# Altium project DCS_MCU.PrjPcb
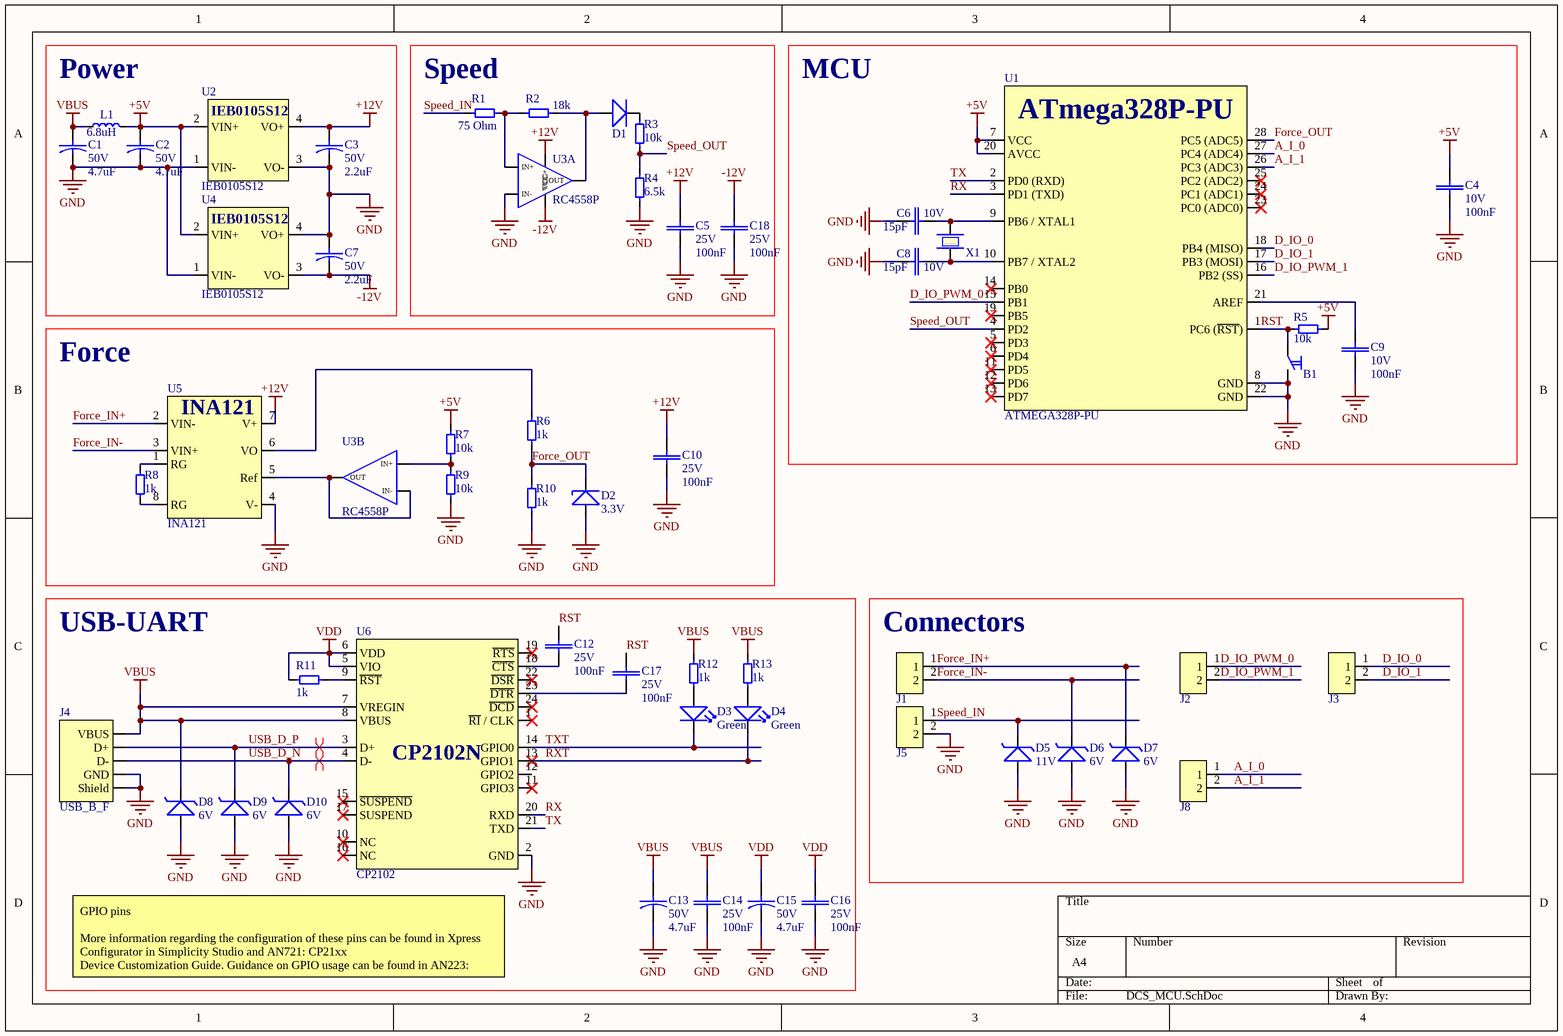
[diagram p0: DCS_MCU.SchDoc]
1 sheet, 55 parts. Net scope: global (net labels, ports and power ports of the same name join across sheets).
Board file: DCS_MCU.PcbDoc

## Sheet DCS_MCU.SchDoc
size A4; SheetNumber: 1; SheetTotal: 1

### Parts
B1  Button_SPST  [Button_small]  (value not drawn)
C1  value 4.7uF  Voltage: 50V  [CAPPRD200W50D400H800]  (hidden comment: Capacitor_NP)
C2  value 4.7uF  Voltage: 50V  [CAPPRD200W50D400H800]  (hidden comment: Capacitor_NP)
C3  value 2.2uF  Voltage: 50V  [CAPPRD200W50D400H800]  (hidden comment: Capacitor_NP)
C4  value 100nF  Voltage: 10V  [CAPRD500W50D400H600]  (hidden comment: Capacitor_NP)
C5  value 100nF  Voltage: 25V  [CAPRD500W50D400H600]  (hidden comment: Capacitor_NP)
C6  value 15pF  Voltage: 10V  [CAPRD500W50D400H600]  (hidden comment: Capacitor_NP)
C7  value 2.2uF  Voltage: 50V  [CAPPRD200W50D400H800]  (hidden comment: Capacitor_NP)
C8  value 15pF  Voltage: 10V  [CAPRD500W50D400H600]  (hidden comment: Capacitor_NP)
C9  value 100nF  Voltage: 10V  [CAPRD500W50D400H600]  (hidden comment: Capacitor_NP)
C10  value 100nF  Voltage: 25V  [CAPRD500W50D400H600]  (hidden comment: Capacitor_NP)
C12  value 100nF  Voltage: 25V  [CAPRD500W50D400H600]  (hidden comment: Capacitor_NP)
C13  value 4.7uF  Voltage: 50V  [CAPPRD200W50D400H800]  (hidden comment: Capacitor_NP)
C14  value 100nF  Voltage: 25V  [CAPRD500W50D400H600]  (hidden comment: Capacitor_NP)
C15  value 4.7uF  Voltage: 50V  [CAPPRD200W50D400H800]  (hidden comment: Capacitor_NP)
C16  value 100nF  Voltage: 25V  [CAPRD500W50D400H600]  (hidden comment: Capacitor_NP)
C17  value 100nF  Voltage: 25V  [CAPRD500W50D400H600]  (hidden comment: Capacitor_NP)
C18  value 100nF  Voltage: 25V  [CAPRD500W50D400H600]  (hidden comment: Capacitor_NP)
D1  Diode  [DIOAD450W35L350D200]  (value not drawn)
D2  Voltage: 3.3V  [DIOAD450W35L350D200]  (hidden comment: Diode_Zener)
D3  Color: Green  [LEDRD254W60D600H1000]  (hidden comment: Diode_LED)
D4  Color: Green  [LEDRD254W60D600H1000]  (hidden comment: Diode_LED)
D5  Voltage: 11V  [DIOAD450W35L350D200]  (hidden comment: Diode_TVS)
D6  Voltage: 6V  [DIOAD450W35L350D200]  (hidden comment: Diode_TVS)
D7  Voltage: 6V  [DIOAD450W35L350D200]  (hidden comment: Diode_TVS)
D8  Voltage: 6V  [DIOAD450W35L350D200]  (hidden comment: Diode_TVS)
D9  Voltage: 6V  [DIOAD450W35L350D200]  (hidden comment: Diode_TVS)
D10  Voltage: 6V  [DIOAD450W35L350D200]  (hidden comment: Diode_TVS)
J1  Terminal_2-pole  [Terminal_2-pole]  (value not drawn)
J2  Terminal_2-pole  [Terminal_2-pole]  (value not drawn)
J3  Terminal_2-pole  [Terminal_2-pole]  (value not drawn)
J4  USB_B_F  [USB_B_F]
J5  Terminal_2-pole  [Terminal_2-pole]  (value not drawn)
J8  Terminal_2-pole  [Terminal_2-pole]  (value not drawn)
L1  value 6.8uH  [INDRD360W60D650H1000]  (hidden comment: Inductor)
R1  value 75 Ohm  [RESAD710W60L610D260]  (hidden comment: Resistor)
R2  value 18k  [RESAD710W60L610D260]  (hidden comment: Resistor)
R3  value 10k  [RESAD710W60L610D260]  (hidden comment: Resistor)
R4  value 6.5k  [RESAD710W60L610D260]  (hidden comment: Resistor)
R5  value 10k  [RESAD710W60L610D260]  (hidden comment: Resistor)
R6  value 1k  [RESAD710W60L610D260]  (hidden comment: Resistor)
R7  value 10k  [RESAD710W60L610D260]  (hidden comment: Resistor)
R8  value 1k  [RESAD710W60L610D260]  (hidden comment: Resistor)
R9  value 10k  [RESAD710W60L610D260]  (hidden comment: Resistor)
R10  value 1k  [RESAD710W60L610D260]  (hidden comment: Resistor)
R11  value 1k  [RESAD710W60L610D260]  (hidden comment: Resistor)
R12  value 1k  [RESAD710W60L610D260]  (hidden comment: Resistor)
R13  value 1k  [RESAD710W60L610D260]  (hidden comment: Resistor)
U1  ATMEGA328P-PU  [DIP790W46P254L3556H508Q28]
U2  IEB0105S12  [SIP600W50P254L1160H1016Q4]
U3  RC4558P  [DIP1092W45P254L1016H508Q8]  (parts A,B of 2)
U4  IEB0105S12  [SIP600W50P254L1160H1016Q4]
U5  INA121  [DIP1092W45P254L1016H508Q8]
U6  CP2102  [QFN25P50_400X400X80L40X24T245N]
X1  Oscillator  [XTAL_HC49P488T45L1150W380H350]  (value not drawn)

### Blocks framed on the sheet
Power: C1-C3 C7 L1 U2 U4
Speed: C5 C18 D1 R1-R4 U3
MCU: B1 C4 C6 C8 C9 R5 U1 X1
Force: C10 D2 R6-R10 U3 U5
USB-UART: C12-C17 D3 D4 D8-D10 J4 R11-R13 U6
Connectors: D5-D7 J1-J3 J5 J8

### Nets
+5V: C2.2 C4.2 L1.2 R5.1 R7.2 U1.7(VCC) U1.20(AVCC) U2.2(VIN+) U4.2(VIN+)
+12V: C3.2 C5.2 C10.2 U2.4(VO+) U3.8(VCC+) U5.7(V+)
-12V: C7.1 C18.2 U3.4(VCC-) U4.3(VO-)
GND: B1.2 C1.1 C2.1 C3.1 C4.1 C5.1 C6.2 C7.2 C8.2 C9.1 C10.1 C13.1 C14.1 C15.1 C16.1 C18.1 D2.A D5.A D6.A D7.A D8.A D9.A D10.A J4.4(GND) J4.5(Shield) J5.2 R4.1 R9.1 R10.1 U1.8(GND) U1.22(GND) U2.1(VIN-) U2.3(VO-) U3.2(IN-) U4.1(VIN-) U4.4(VO+) U5.4(V-) U6.2(GND)
VBUS: C1.2 C13.2 C14.2 D8.C J4.2(VBUS) L1.1 R12.2 R13.2 U6.7(VREGIN) U6.8(VBUS)
VDD: C15.2 C16.2 R11.1 U6.5(VIO) U6.6(VDD)
A_I_0: J8.1 U1.27(PC4_(ADC4))
A_I_1: J8.2 U1.26(PC3_(ADC3))
D_IO_0: J3.1 U1.18(PB4_(MISO))
D_IO_1: J3.2 U1.17(PB3_(MOSI))
D_IO_PWM_0: J2.1 U1.15(PB1)
D_IO_PWM_1: J2.2 U1.16(PB2_(SS))
Force_IN+: D7.C J1.1 U5.2(VIN-)
Force_IN-: D6.C J1.2 U5.3(VIN+)
Force_OUT: D2.C R6.1 R10.2 U1.28(PC5_(ADC5))
RST: B1.1 C12.1 C17.1 R5.2 U1.1(PC6_(~{RST}))
RX: U1.3(PD1_(TXD)) U6.20(RXD)
RXT: D4.C U6.13(GPIO1)
Speed_IN: D5.C J5.1 R1.1
Speed_OUT: R3.1 R4.2 U1.4(PD2)
TX: U1.2(PD0_(RXD)) U6.21(TXD)
TXT: D3.C U6.14(GPIO0)
USB_D_N: D10.C J4.1(D-) U6.4(D-)
USB_D_P: D9.C J4.3(D+) U6.3(D+)
NetC6_1: C6.1 U1.9(PB6_/_XTAL1) X1.2
NetC8_1: C8.1 U1.10(PB7_/_XTAL2) X1.1
NetC9_2: C9.2 U1.21(AREF)
NetC12_2: C12.2 U6.18(~{CTS})
NetC17_2: C17.2 U6.23(~{DTR})
NetD1_A: D1.A R2.2 U3.1(OUT)
NetD1_C: D1.C R3.2
NetD3_A: D3.A R12.1
NetD4_A: D4.A R13.1
NetR1_2: R1.2 R2.1 U3.3(IN+)
NetR6_2: R6.2 U5.6(VO)
NetR7_1: R7.1 R9.2 U3.5(IN+)
NetR8_1: R8.1 U5.8(RG)
NetR8_2: R8.2 U5.1(RG)
NetR11_2: R11.2 U6.9(~{RST})
NetU3_6: U3.6(IN-) U3.7(OUT) U5.5(Ref)

Not connected (* = marked no-connect by the designer): U1 5(PD3)* 6(PD4)* 11(PD5)* 12(PD6)* 13(PD7)* 14(PB0)* 19(PB5)* 23(PC0_(ADC0))* 24(PC1_(ADC1))* 25(PC2_(ADC2))*; U6 1(~{RI}_/_CLK)* 10(NC)* 11(GPIO3)* 12(GPIO2) 15(~{SUSPEND})* 16(NC)* 17(SUSPEND)* 19(~{RTS})* 22(~{DSR})* 24(~{DCD})*

### Layout directives
differential pair: USB_D_N, USB_D_P

### Notes on the sheet
- (near U6) GPIO pins
  More information regarding the configuration of these pins can be found in Xpress Configurator in Simplicity Studio and AN721: CP21xx
  Device Customization Guide. Guidance on GPIO usage can be found in AN223: Runtime GPIO Control for CP210x.
- (in symbol ATMEGA328P-PU) ATmega328P-PU
- (in symbol CP2102) CP2102N

### Library data of the parts
B1 = Button_SPST_NO
C1-C3 C7 C13 C15 = Capacitor_P
D1 = Diode_Rectifier